# Altium project PTW_Mosfet_V1.0.PrjPcb
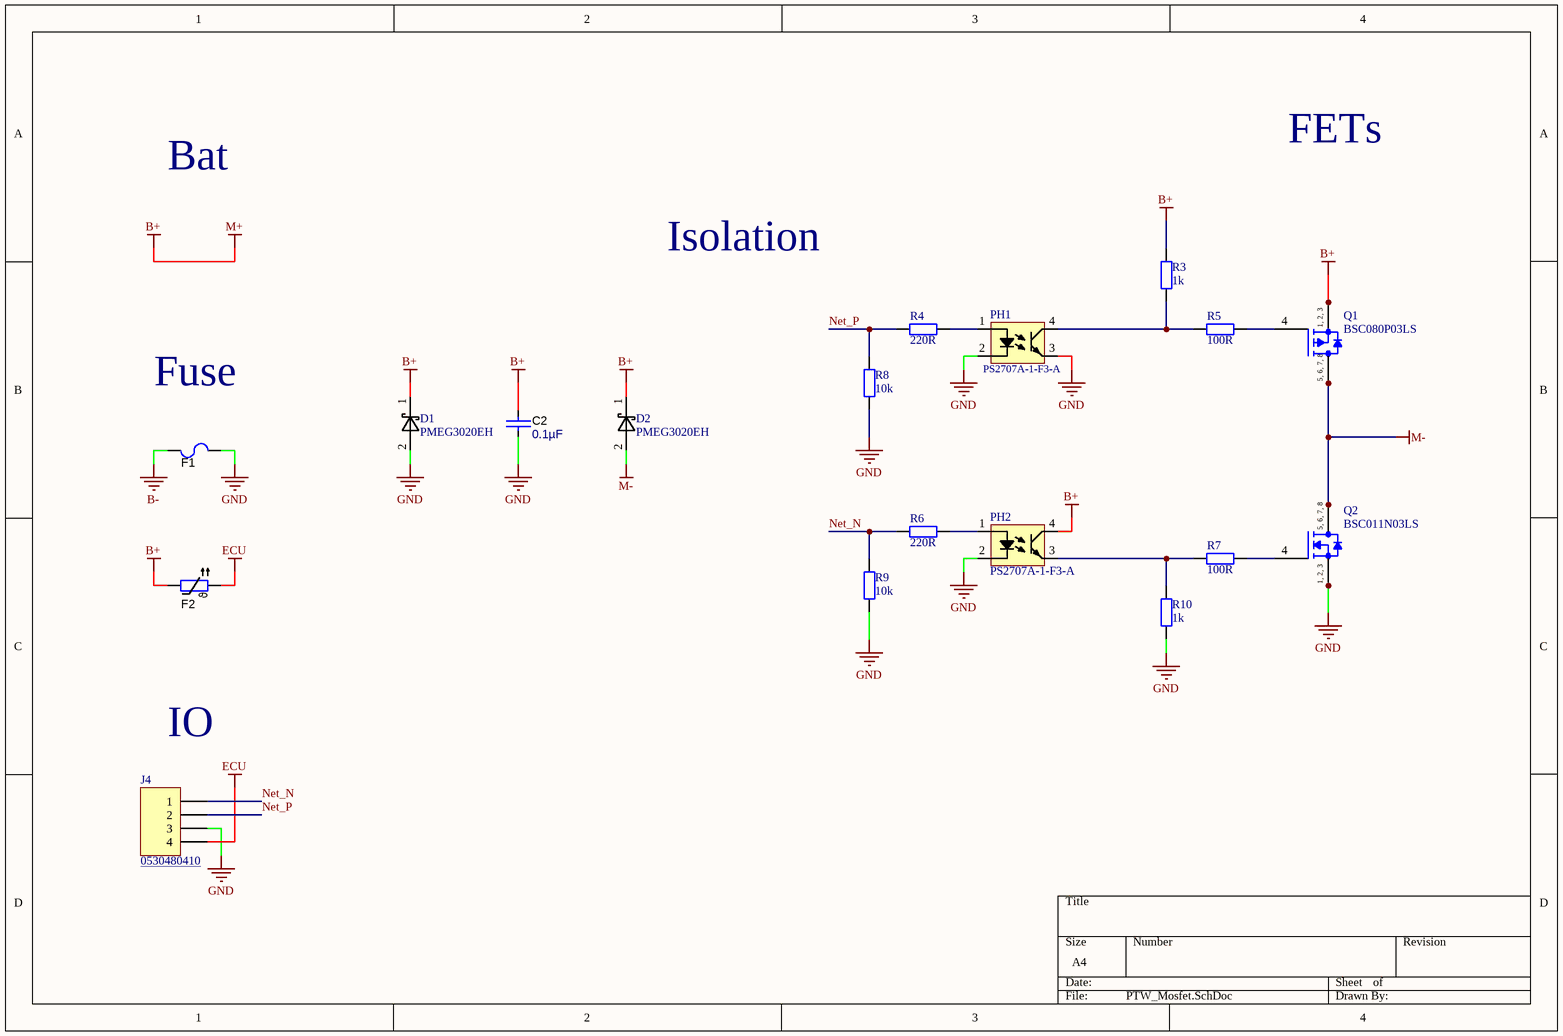
[diagram p0: PTW_Mosfet.SchDoc]
1 sheet, 18 parts. Net scope: global (net labels, ports and power ports of the same name join across sheets).
Board file: PTW_Mosfet_V1.0.PcbDoc

## Sheet PTW_Mosfet.SchDoc
size A4

### Parts
C2  0.1µF  [CAPC0402(1005)60_N]
D1  PMEG3020EH  [SOD123F]
D2  PMEG3020EH  [SOD123F]
F1  Keystone3569  [Keystone3569]  (value not drawn)
F2  MF-FSMF050X-2  [0603 _N]  (value not drawn)
J4  0530480410  [0530480410]
PH1  PS2707A-1-F3-A  [SOP-4]
PH2  PS2707A-1-F3-A  [SOP-4]
Q1  BSC080P03LS  [TDSON-8-1-Infineon]
Q2  BSC011N03LS  [TDSON-8-1-Infineon]
R3  1k  [RESC0402(1005)_N]
R4  220R  [RESC0402(1005)_N]
R5  100R  [RESC0402(1005)_N]
R6  220R  [RESC0402(1005)_N]
R7  100R  [RESC0402(1005)_N]
R8  10k  [RESC0402(1005)_N]
R9  10k  [RESC0402(1005)_N]
R10  1k  [RESC0402(1005)_N]

### Nets
B+: C2.1 D1.1 D2.1 F2.1 PH2.4 Q1.1(S) Q1.2(S) Q1.3(S) R3.1  [also labelled M+]
B-: F1.1
ECU: F2.2 J4.4
GND: C2.2 D1.2 F1.2 J4.3 PH1.2 PH1.3 PH2.2 Q2.1(S) Q2.2(S) Q2.3(S) R8.2 R9.2 R10.2
M-: D2.2 Q1.5(D) Q1.6(D) Q1.7(D) Q1.8(D) Q1.9(D) Q2.5(D) Q2.6(D) Q2.7(D) Q2.8(D) Q2.9(D)
Net_N: J4.1 R6.1 R9.1
Net_P: J4.2 R4.1 R8.1
NetPH1_1: PH1.1 R4.2
NetPH1_4: PH1.4 R3.2 R5.1
NetPH2_1: PH2.1 R6.2
NetPH2_3: PH2.3 R7.1 R10.1
NetQ1_4: Q1.4(G) R5.2
NetQ2_4: Q2.4(G) R7.2

### Notes on the sheet
- Bat
- FETs
- Isolation
- Fuse
- IO
- (in symbol BSC011N03LS) 5, 6, 7, 8; 1, 2, 3
- (in symbol BSC080P03LS) 1, 2, 3; 5, 6, 7, 8
- (in symbol MF-FSMF050X-2) ϑ

### Library data of the parts
C2 = CAPC_25V_X5R_0.47µF_0402: Capacitor SMD Cer 0.1µF 10% 25V X5R 0402; Manufacturer: TDK; Manufacturer Part Number: C1005X5R1E105K050BC; Betriebstemperatur: -55°C bis 85°C; Dicke: 0.55mm; Tolerance: 10%; Package / Case: 0402 (1005 metric); Spannung - Nenn: 25V; Temperaturwirkungsgrad: X5R; Value: 0.1µF
D1 D2 = PMEG3020EH: Diode Shottky 30V, 2A; Manufacturer: ON Semiconductor; ComponentLink1Description: Manufacturer URL; ComponentLink2Description: Datasheet; Manufacturer Part: PMEG3020EH; Current - Peak Pulse: 2A; Operating Temperature: -65°C ~ 150°C
F1 = Keystone3569: Keystone Blade Fuse SMD; Current hold: 30A; Peak: 40A; Current Trip: 50A; Trip-Time: 5s; Rmin: 0.005 ~ 0.025Ohm; Volt: 16V; Material: Keystone; Package / Case: 3569
F2 = MF-FSMF050X-2: PTC 6V 0.5A (h), 1s (t) @ 1A; Peak: 40A; Material: Bourns Inc.; Rmin: 0.1 ~ 0.8Ohm; Current hold: 0.5A; Package / Case: 0603; Current Trip: 1A; Trip-Time: 1s; Volt: 6V
J4 = 0530480410: Molex Picoblade, 3Pin THT Straight; ComponentLink1Description: Datasheet; ComponentLink1URL: http://www.molex.com/pdm_docs/sd/530470310_sd.pdf
PH1 PH2 = PS2707A-1-F3-A: 1-ch optocoupler 3.75kV; Manufacturer: NEC; Betriebstemperatur: -55°C bis 100°C; Rise/Fall-time: 5µs/7µs; Output: Transistor; Input: DC; Chanel: 1; Package / Case: 4-SOP; Manufacturer Part Number: PS2707A-1-F3-A; Isolation: 3.75kV; ComponentLink1Description: Datasheet; ComponentLink1URL: http://www.cel.com/pdf/datasheets/ps2701a1.pdf
Q1 = BSC080P03LS: 30V P-Channel OptiMOSPower-MOSFET; FET Feature: Logic Level Gate; Current - Continuous Drain (Id) @ 25°C: 16A (Ta), 30A (Tc); Rds On (Max) @ Id, Vgs: 8 mOhm @ 30A, 10V; Vgs(th) (Max) @ Id: 1V @ 250µA; Gate Charge (Qg) @ Vgs: 122.4nC @ 10V; Input Capacitance (Ciss) @ Vds: 6140pF @ 15V; Rating: 89W; FET Type: MOSFET P-Channel, Metal Oxide; ComponentLink1Description: Datasheet; ComponentLink2Description: Web Page; ComponentLink1URL: http://www.infineon.com/dgdl/BSC080P03LS+G_Rev1.03.pdf?folderId=db3a304314dca38901154a7313d21a66&fileId=db3a304314dca38901154a7800621a6c; ComponentLink2URL: http://www.infineon.com/cms/en/product/power/mosfet/power-mosfet/p-channel-20v-250v/BSC080P03LS+G/productType.html?productType=db3a3044139a1b9f0113af5a501403f0; Drain to Source Voltage (Vdss): 30V; Mounting Type: Surface Mount; Package / Case: 8-PowerTDFN; ComponentLink3Description: Package Page; ComponentLink3URL: http://www.infineon.com/dgdl/Infineon+-+Application+Note+-+PowerMOSFETs+-+OptiMOS%E2%84%A2+-+Recommendations+for+Board+Assembly+PG-T%28S%29DSON+Packages.pdf?folderId=db3a304314dca389011528372fbb12ac&fileId=db3a30433e30e4bf013e368e34f51779; Supplier 1: Mouser; Supplier 2: Digi-Key; Supplier Part Number 1: 726-BSC080P03LSG; Supplier Part Number 2: BSC080P03LS GCT-ND
Q2 = BSC011N03LS: 30V N-Channel OptiMOSPower-MOSFET; FET Feature: Logic Level Gate; Current - Continuous Drain (Id) @ 25°C: 37A (Ta), 100A (Tc); Rds On (Max) @ Id, Vgs: 1.1 mOhm @ 30A, 10V; Vgs(th) (Max) @ Id: 2.2V @ 250µA; Gate Charge (Qg) @ Vgs: 72nC @ 10V; Input Capacitance (Ciss) @ Vds: 4700pF @ 15V; Rating: 96W; FET Type: MOSFET N-Channel, Metal Oxide; ComponentLink1Description: Datasheet; ComponentLink2Description: Web Page; ComponentLink1URL: http://www.infineon.com/dgdl/BSC011N03LS_Rev+1.2.pdf?folderId=db3a304313b8b5a60113cee8763b02d7&fileId=db3a30432c64a60d012cbb2c20ff02a0; ComponentLink2URL: http://www.infineon.com/cms/en/product/power/mosfet/power-mosfet/n-channel-optimos-tm-20v-30v/BSC011N03LS/productType.html?productType=db3a304426e7f13b0127055776321af0; Drain to Source Voltage (Vdss): 30V; Mounting Type: Surface Mount; Package / Case: 8-PowerTDFN; ComponentLink3Description: Package Page; ComponentLink3URL: http://www.infineon.com/dgdl/Infineon+-+Application+Note+-+PowerMOSFETs+-+OptiMOS%E2%84%A2+-+Recommendations+for+Board+Assembly+PG-T%28S%29DSON+Packages.pdf?folderId=db3a304314dca389011528372fbb12ac&fileId=db3a30433e30e4bf013e368e34f51779; Supplier 1: Mouser; Supplier 2: Digi-Key; Supplier Part Number 1: 726-BSC011N03LS; Supplier Part Number 2: BSC011N03LSCT-ND
R3-R10 = RES_0402: R_0402; Tolerance: ±?%; Ratings: 1/10W; Package / Case: 0402 (1005 metric); Manufacturer: ?; Manufacturer Part Number: ?
  R3 R10: Value: 1k
  R4 R6: Value: 220R
  R5 R7: Value: 100R
  R8 R9: Value: 10k